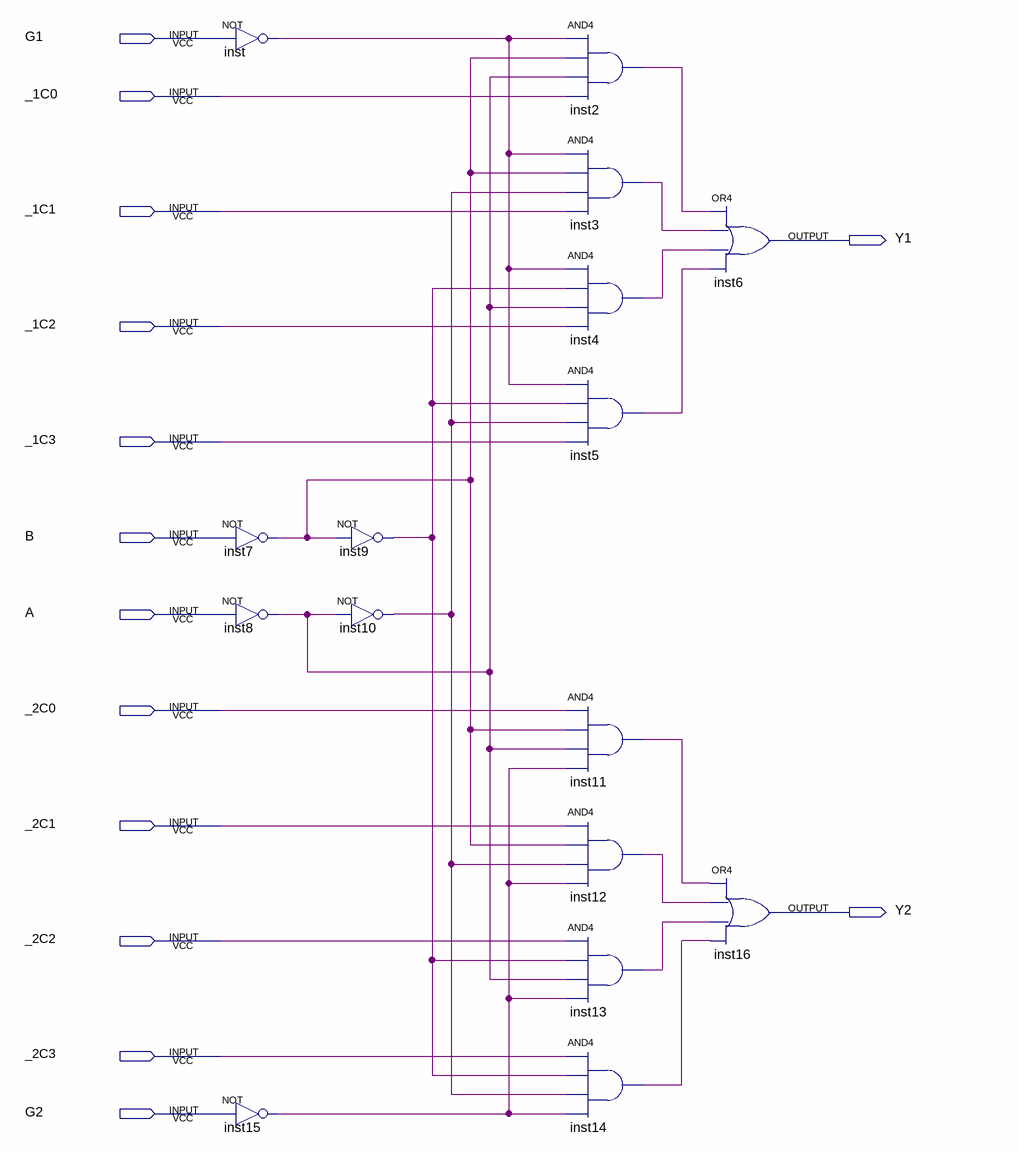
[diagram p0: schematic sheet]
// Quartus schematic DM74LS153.bdf as structural Verilog: 16 symbols, 14 pins
module DM74LS153 (
  input  G1,
  input  _1C0,
  input  _1C1,
  input  _1C2,
  input  _1C3,
  input  B,
  input  A,
  input  _2C0,
  input  _2C1,
  input  _2C2,
  input  _2C3,
  input  G2,
  output Y1,
  output Y2
);

  wire inst2_out, inst3_out, inst4_out, inst5_out, inst7_out, inst8_out, inst9_out, inst10_out, inst11_out,
       inst12_out, inst13_out, inst14_out, inst15_out, inst_out;

  not inst (inst_out, G1);
  not inst7 (inst7_out, B);
  not inst8 (inst8_out, A);
  not inst15 (inst15_out, G2);
  not inst9 (inst9_out, inst7_out);
  not inst10 (inst10_out, inst8_out);
  and inst2 (inst2_out, inst_out, inst7_out, inst8_out, _1C0);
  and inst3 (inst3_out, inst_out, inst7_out, inst10_out, _1C1);
  and inst4 (inst4_out, inst_out, inst9_out, inst8_out, _1C2);
  and inst5 (inst5_out, inst_out, inst9_out, inst10_out, _1C3);
  and inst11 (inst11_out, _2C0, inst7_out, inst8_out, inst15_out);
  and inst12 (inst12_out, _2C1, inst7_out, inst10_out, inst15_out);
  and inst13 (inst13_out, _2C2, inst9_out, inst8_out, inst15_out);
  and inst14 (inst14_out, _2C3, inst9_out, inst10_out, inst15_out);
  or inst6 (Y1, inst2_out, inst3_out, inst4_out, inst5_out);
  or inst16 (Y2, inst11_out, inst12_out, inst13_out, inst14_out);
endmodule
